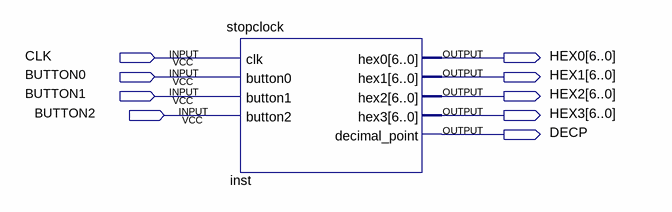
[diagram p0: schematic sheet]
// Quartus schematic stopClockBlock.bdf as structural Verilog: 1 symbols, 9 pins
module stopClockBlock (
  input  CLK,
  input  BUTTON0,
  input  BUTTON1,
  input  BUTTON2,
  output [6:0] HEX0,
  output [6:0] HEX1,
  output [6:0] HEX2,
  output [6:0] HEX3,
  output DECP
);

  stopclock inst (
    .clk(CLK), .button0(BUTTON0), .button1(BUTTON1), .hex0(HEX0), .hex1(HEX1), .hex2(HEX2), .hex3(HEX3),
    .decimal_point(DECP));  // open: button2
endmodule
